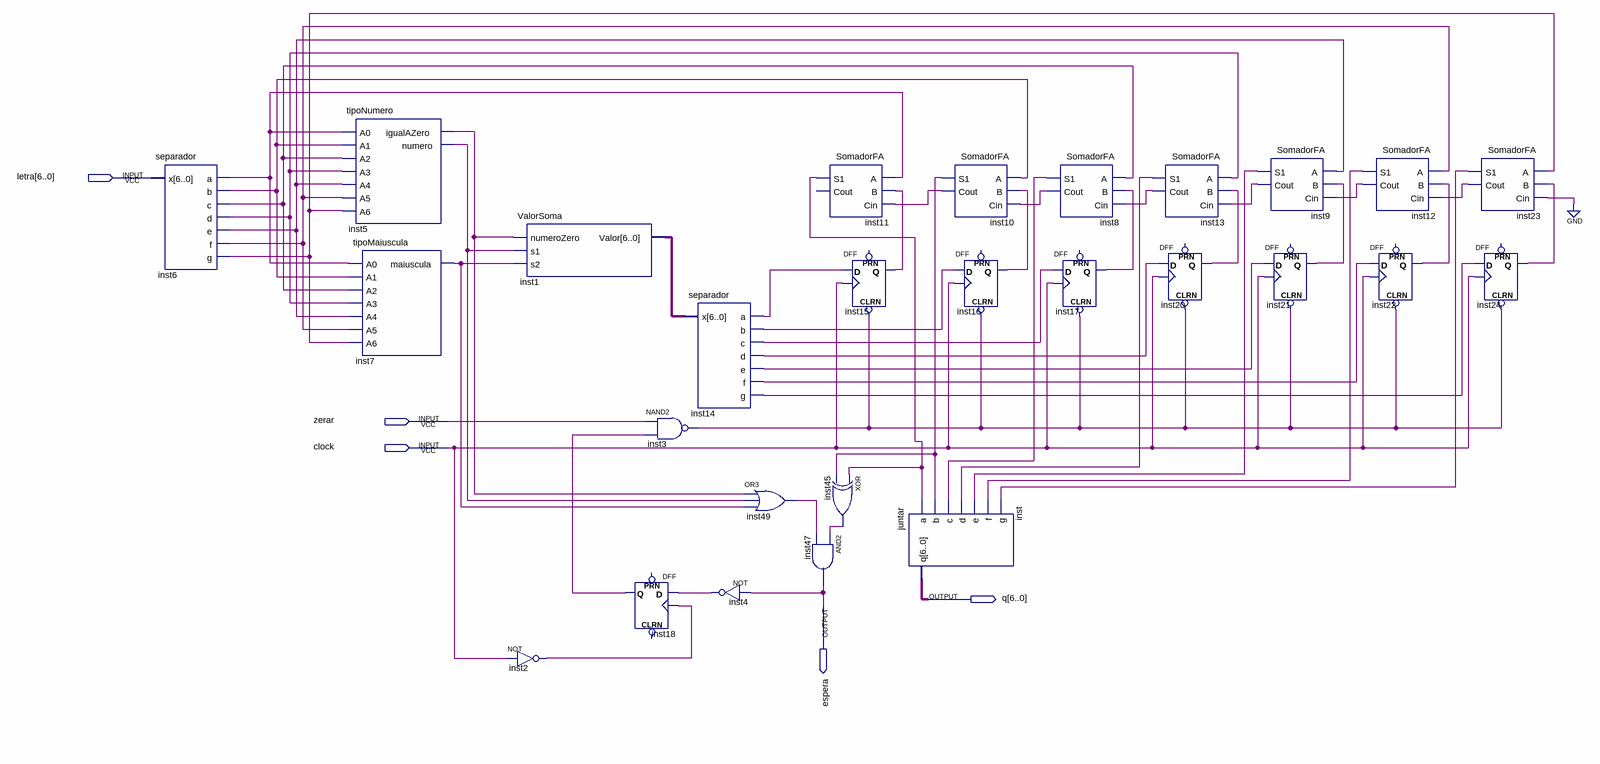
[diagram p0: schematic sheet]
// Quartus schematic Somar.bdf as structural Verilog: 27 symbols, 5 pins
module Somar (
  input  [6:0] letra,
  input  zerar,
  input  clock,
  output [6:0] q,
  output espera
);

  wire inst2_out, inst3_out, inst4_out, inst5_igualazero, inst5_numero, inst6_a, inst6_b, inst6_c, inst6_d,
       inst6_e, inst6_f, inst6_g, inst7_maiuscula, inst8_cout, inst8_s1, inst9_cout, inst9_s1, inst10_cout,
       inst10_s1, inst11_s1, inst12_cout, inst12_s1, inst13_cout, inst13_s1, inst14_a, inst14_b, inst14_c,
       inst14_d, inst14_e, inst14_f, inst14_g, inst15_q, inst16_q, inst17_q, inst18_q, inst20_q, inst21_q,
       inst22_q, inst23_cout, inst23_s1, inst24_q, inst45_out, inst49_out;
  wire [6:0] inst1_valor;

  separador inst6 (
    .x(letra), .a(inst6_a), .b(inst6_b), .c(inst6_c), .d(inst6_d), .e(inst6_e), .f(inst6_f), .g(inst6_g));
  tipoNumero inst5 (
    .A0(inst6_a), .A1(inst6_b), .A2(inst6_c), .A3(inst6_d), .A4(inst6_e), .A5(inst6_f), .A6(inst6_g),
    .igualAZero(inst5_igualazero), .numero(inst5_numero));
  tipoMaiuscula inst7 (
    .A0(inst6_a), .A1(inst6_b), .A2(inst6_c), .A3(inst6_d), .A4(inst6_e), .A5(inst6_f), .A6(inst6_g),
    .maiuscula(inst7_maiuscula));
  ValorSoma inst1 (.numeroZero(inst5_igualazero), .s1(inst5_numero), .s2(inst7_maiuscula), .Valor(inst1_valor));
  not inst2 (inst2_out, clock);
  DFF inst18 (.CLK(inst2_out), .D(inst4_out), .Q(inst18_q));  // open: CLRN, PRN
  separador inst14 (
    .x(inst1_valor), .a(inst14_a), .b(inst14_b), .c(inst14_c), .d(inst14_d), .e(inst14_e), .f(inst14_f),
    .g(inst14_g));
  nand inst3 (inst3_out, zerar, inst18_q);
  not inst4 (inst4_out, espera);
  or inst49 (inst49_out, inst5_igualazero, inst5_numero, inst7_maiuscula);
  SomadorFA inst11 (.A(inst6_a), .B(inst15_q), .Cin(inst10_cout), .S1(inst11_s1));  // open: Cout
  DFF inst15 (.CLRN(inst3_out), .CLK(clock), .D(inst14_a), .Q(inst15_q));  // open: PRN
  xor inst45 (inst45_out, inst11_s1, inst10_s1);
  and inst47 (espera, inst45_out, inst49_out);
  juntar inst (
    .a(inst11_s1), .b(inst10_s1), .c(inst8_s1), .d(inst13_s1), .e(inst9_s1), .f(inst12_s1), .g(inst23_s1),
    .q(q));
  SomadorFA inst10 (.A(inst6_b), .B(inst16_q), .Cin(inst8_cout), .S1(inst10_s1), .Cout(inst10_cout));
  DFF inst16 (.CLRN(inst3_out), .CLK(clock), .D(inst14_b), .Q(inst16_q));  // open: PRN
  SomadorFA inst8 (.A(inst6_c), .B(inst17_q), .Cin(inst13_cout), .S1(inst8_s1), .Cout(inst8_cout));
  DFF inst17 (.CLRN(inst3_out), .CLK(clock), .D(inst14_c), .Q(inst17_q));  // open: PRN
  SomadorFA inst13 (.A(inst6_d), .B(inst20_q), .Cin(inst9_cout), .S1(inst13_s1), .Cout(inst13_cout));
  DFF inst20 (.CLRN(inst3_out), .CLK(clock), .D(inst14_d), .Q(inst20_q));  // open: PRN
  SomadorFA inst9 (.A(inst6_e), .B(inst21_q), .Cin(inst12_cout), .S1(inst9_s1), .Cout(inst9_cout));
  DFF inst21 (.CLRN(inst3_out), .CLK(clock), .D(inst14_e), .Q(inst21_q));  // open: PRN
  SomadorFA inst12 (.A(inst6_f), .B(inst22_q), .Cin(inst23_cout), .S1(inst12_s1), .Cout(inst12_cout));
  DFF inst22 (.CLRN(inst3_out), .CLK(clock), .D(inst14_f), .Q(inst22_q));  // open: PRN
  SomadorFA inst23 (.A(inst6_g), .B(inst24_q), .Cin(1'b0), .S1(inst23_s1), .Cout(inst23_cout));
  DFF inst24 (.CLRN(inst3_out), .CLK(clock), .D(inst14_g), .Q(inst24_q));  // open: PRN
endmodule
